# Altium project Fly_Project.PrjPcb
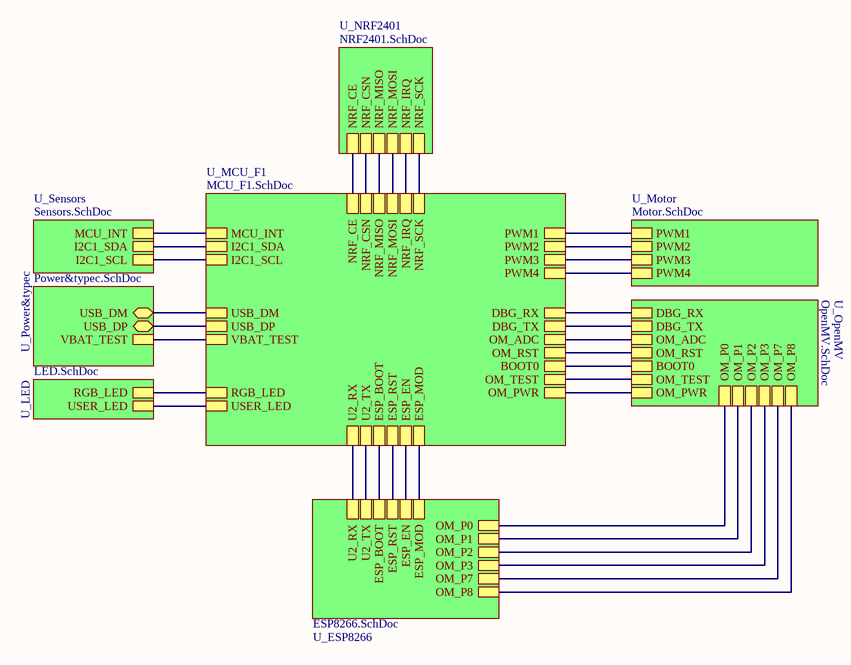
[diagram p0: Fly.SchDoc]
5 sheets, 49 parts. Net scope: hierarchical (ports join the sheet entries above them; power ports are global).
Board file: Fly.PcbDoc
Sheets:
  Fly.SchDoc
    U_LED = LED.SchDoc
    U_Sensors = Sensors.SchDoc
    U_NRF2401 = NRF2401.SchDoc
    U_OpenMV = OpenMV.SchDoc

## Sheet Fly.SchDoc
size A4

### Sub-sheets
U_ESP8266 = ESP8266.SchDoc (file not in this document): OM_P0, OM_P1, OM_P2, OM_P3, OM_P7, OM_P8, U2_RX, U2_TX, ESP_BOOT, ESP_RST, ESP_EN, ESP_MOD
U_LED = LED.SchDoc: RGB_LED, USER_LED
U_MCU_F1 = MCU_F1.SchDoc (file not in this document): OM_PWR, OM_TEST, OM_RST, VBAT_TEST, OM_ADC, U2_TX, USB_DP, USB_DM, DBG_RX, DBG_TX, NRF_CE, NRF_MOSI, NRF_MISO, NRF_SCK, NRF_CSN, U2_RX, ESP_EN, ESP_BOOT, PWM1, PWM2, PWM3, PWM4, NRF_IRQ, RGB_LED, USER_LED, BOOT0, I2C1_SDA, I2C1_SCL, ESP_RST, MCU_INT, ESP_MOD
U_Motor = Motor.SchDoc (file not in this document): PWM1, PWM2, PWM4, PWM3
U_NRF2401 = NRF2401.SchDoc: NRF_CE, NRF_CSN, NRF_MISO, NRF_MOSI, NRF_IRQ, NRF_SCK
U_OpenMV = OpenMV.SchDoc: OM_P8, OM_P7, OM_P0, OM_P1, OM_P2, OM_P3, DBG_RX, DBG_TX, OM_ADC, OM_RST, BOOT0, OM_TEST, OM_PWR
U_Power&typec = Power&typec.SchDoc (file not in this document): VBAT_TEST, USB_DM, USB_DP
U_Sensors = Sensors.SchDoc: MCU_INT, I2C1_SCL, I2C1_SDA

### Nets
BOOT0: sheet U_OpenMV/BOOT0, sheet U_MCU_F1/BOOT0
I2C1_SCL: sheet U_Sensors/I2C1_SCL, sheet U_MCU_F1/I2C1_SCL
I2C1_SDA: sheet U_Sensors/I2C1_SDA, sheet U_MCU_F1/I2C1_SDA
OM_RST: sheet U_OpenMV/OM_RST, sheet U_MCU_F1/OM_RST
OM_TEST: sheet U_OpenMV/OM_TEST, sheet U_MCU_F1/OM_TEST
NetD9_2: sheet U_LED/RGB_LED, sheet U_MCU_F1/RGB_LED
NetD11_2: sheet U_LED/USER_LED, sheet U_MCU_F1/USER_LED
NetJ1_3: sheet U_OpenMV/OM_P7, sheet U_ESP8266/OM_P7
NetJ1_4: sheet U_OpenMV/OM_P8, sheet U_ESP8266/OM_P8
NetJ2_2: sheet U_OpenMV/OM_ADC, sheet U_MCU_F1/OM_ADC
NetJ2_3: sheet U_OpenMV/DBG_TX, sheet U_MCU_F1/DBG_TX
NetJ2_4: sheet U_OpenMV/DBG_RX, sheet U_MCU_F1/DBG_RX
NetJ2_5: sheet U_OpenMV/OM_P3, sheet U_ESP8266/OM_P3
NetJ2_6: sheet U_OpenMV/OM_P2, sheet U_ESP8266/OM_P2
NetJ2_7: sheet U_OpenMV/OM_P1, sheet U_ESP8266/OM_P1
NetJ2_8: sheet U_OpenMV/OM_P0, sheet U_ESP8266/OM_P0
NetR34_1: sheet U_OpenMV/OM_PWR, sheet U_MCU_F1/OM_PWR
NetU4_1: sheet U_NRF2401/NRF_CE, sheet U_MCU_F1/NRF_CE
NetU4_2: sheet U_NRF2401/NRF_CSN, sheet U_MCU_F1/NRF_CSN
NetU4_3: sheet U_NRF2401/NRF_SCK, sheet U_MCU_F1/NRF_SCK
NetU4_4: sheet U_NRF2401/NRF_MOSI, sheet U_MCU_F1/NRF_MOSI
NetU4_5: sheet U_NRF2401/NRF_MISO, sheet U_MCU_F1/NRF_MISO
NetU4_6: sheet U_NRF2401/NRF_IRQ, sheet U_MCU_F1/NRF_IRQ
NetU6_12: sheet U_Sensors/MCU_INT, sheet U_MCU_F1/MCU_INT
(unnamed): sheet U_Power&typec/VBAT_TEST, sheet U_MCU_F1/VBAT_TEST
(unnamed): sheet U_Power&typec/USB_DM, sheet U_MCU_F1/USB_DM
(unnamed): sheet U_Power&typec/USB_DP, sheet U_MCU_F1/USB_DP
(unnamed): sheet U_Motor/PWM1, sheet U_MCU_F1/PWM1
(unnamed): sheet U_Motor/PWM2, sheet U_MCU_F1/PWM2
(unnamed): sheet U_Motor/PWM4, sheet U_MCU_F1/PWM4
(unnamed): sheet U_Motor/PWM3, sheet U_MCU_F1/PWM3
(unnamed): sheet U_ESP8266/U2_RX, sheet U_MCU_F1/U2_RX
(unnamed): sheet U_ESP8266/U2_TX, sheet U_MCU_F1/U2_TX
(unnamed): sheet U_ESP8266/ESP_BOOT, sheet U_MCU_F1/ESP_BOOT
(unnamed): sheet U_ESP8266/ESP_RST, sheet U_MCU_F1/ESP_RST
(unnamed): sheet U_ESP8266/ESP_EN, sheet U_MCU_F1/ESP_EN
(unnamed): sheet U_ESP8266/ESP_MOD, sheet U_MCU_F1/ESP_MOD

## Sheet LED.SchDoc
size A3; Organization: Altium Limited; Address1: L3, 12a Rodborough Rd; Address2: Frenchs Forest; Address3: NSW; Address4: Australia 2086
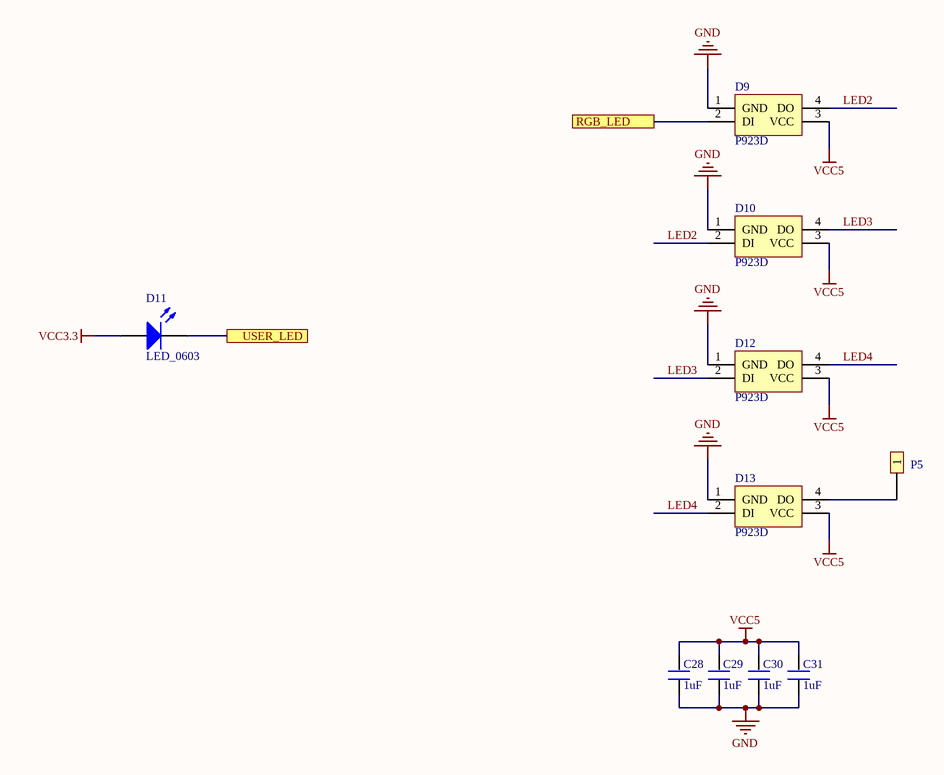
[diagram p1: LED.SchDoc]

### Parts
C28  1uF  [0603P]
C29  1uF  [0603P]
C30  1uF  [0603P]
C31  1uF  [0603P]
D9  P923D  [RGB_LED_5050]
D10  P923D  [RGB_LED_5050]
D11  LED_0603  [LED-0603]
D12  P923D  [RGB_LED_5050]
D13  P923D  [RGB_LED_5050]
P5  Header 1  [HEADER1]  (value not drawn)

### Ports
RGB_LED, USER_LED

### Nets
GND: C28.1 C29.1 C30.1 C31.1 D9.1(GND) D10.1(GND) D12.1(GND) D13.1(GND)
VCC3.3: D11.1
VCC5: C28.2 C29.2 C30.2 C31.2 D9.3(VCC) D10.3(VCC) D12.3(VCC) D13.3(VCC)
LED2: D9.4(DO) D10.2(DI)
LED3: D10.4(DO) D12.2(DI)
LED4: D12.4(DO) D13.2(DI)
NetD9_2: D9.2(DI) ; port RGB_LED
NetD11_2: D11.2 ; port USER_LED
NetD13_4: D13.4(DO) P5.1

### Notes on the sheet
- Title
- Size:
- Date:
- A3
- Number:
- Time:
- Revision:
- Sheet
- of
- File:

### Library data of the parts
C28-C31 = C
D11 = LED 0603: 发光二极管; Published: 8-Jun-2000; LatestRevisionDate: 08-Jul-2005; LatestRevisionNote: Mech Layer 1 removed.; PackageReference: LED-0; Publisher: Altium Limited; PackageDescription: LED; 2 Leads
D9 D10 D12 D13 = P923D: Publisher: mazhongwei; Published: 8-August-2017; PackageReference: RGB_LED_5050
P5 = Header 1: LatestRevisionDate: 17-Jul-2002; LatestRevisionNote: Re-released for DXP Platform.; Publisher: Altium Limited

## Sheet Sensors.SchDoc
size A3; Organization: Altium Limited; Address1: L3, 12a Rodborough Rd; Address2: Frenchs Forest; Address3: NSW; Address4: Australia 2086
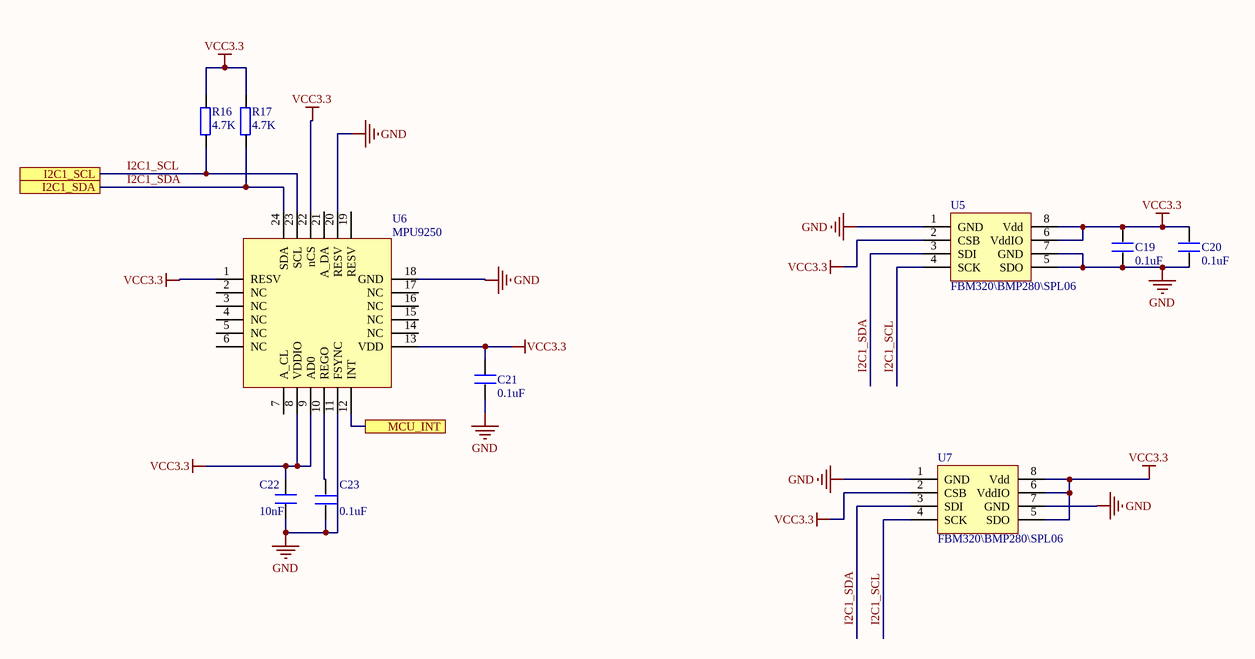
[diagram p2: Sensors.SchDoc]

### Parts
C19  0.1uF  [0603P]
C20  0.1uF  [0603P]
C21  0.1uF  [0603P]
C22  10nF  [0603P]
C23  0.1uF  [0603P]
R16  4.7K  [0603P]
R17  4.7K  [0603P]
U5  FBM320\BMP280\SPL06  [LGA-2_5X2MM]
U6  MPU9250  [QFN24-0.4]
U7  FBM320\BMP280\SPL06  [LGA-2_5X2MM]

### Ports
I2C1_SCL, I2C1_SDA, MCU_INT

### Nets
GND: C19.1 C20.1 C21.1 C22.1 C23.2 U5.1(GND) U5.5(SDO) U5.7(GND) U6.11(FSYNC) U6.18(GND) U6.20(RESV) U7.1(GND) U7.7(GND)
VCC3.3: C19.2 C20.2 C21.2 C22.2 R16.1 R17.1 U5.2(CSB) U5.6(VddIO) U5.8(Vdd) U6.1(RESV) U6.8(VDDIO) U6.9(AD0) U6.13(VDD) U6.22(nCS) U7.2(CSB) U7.5(SDO) U7.6(VddIO) U7.8(Vdd)
I2C1_SCL: R16.2 U5.4(SCK) U6.23(SCL) U7.4(SCK) ; port I2C1_SCL
I2C1_SDA: R17.2 U5.3(SDI) U6.24(SDA) U7.3(SDI) ; port I2C1_SDA
NetC23_1: C23.1 U6.10(REGO)
NetU6_12: U6.12(INT) ; port MCU_INT

Not connected (* = marked no-connect by the designer): U6 2(NC) 3(NC) 4(NC) 5(NC) 6(NC) 7(A_CL) 14(NC) 15(NC) 16(NC) 17(NC) 19(RESV) 21(A_DA)

### Notes on the sheet
- Title
- Size:
- Date:
- A3
- Number:
- Time:
- Revision:
- Sheet
- of
- File:

### Library data of the parts
C19-C23 = C
R16 R17 = R
U5 U7 = FBM320: 气压计; Published: 8-August-2017; Publisher: mazhongwei; PackageReference: LGA-2_5X2MM

## Sheet NRF2401.SchDoc
size A3; Organization: Altium Limited; Address1: L3, 12a Rodborough Rd; Address2: Frenchs Forest; Address3: NSW; Address4: Australia 2086
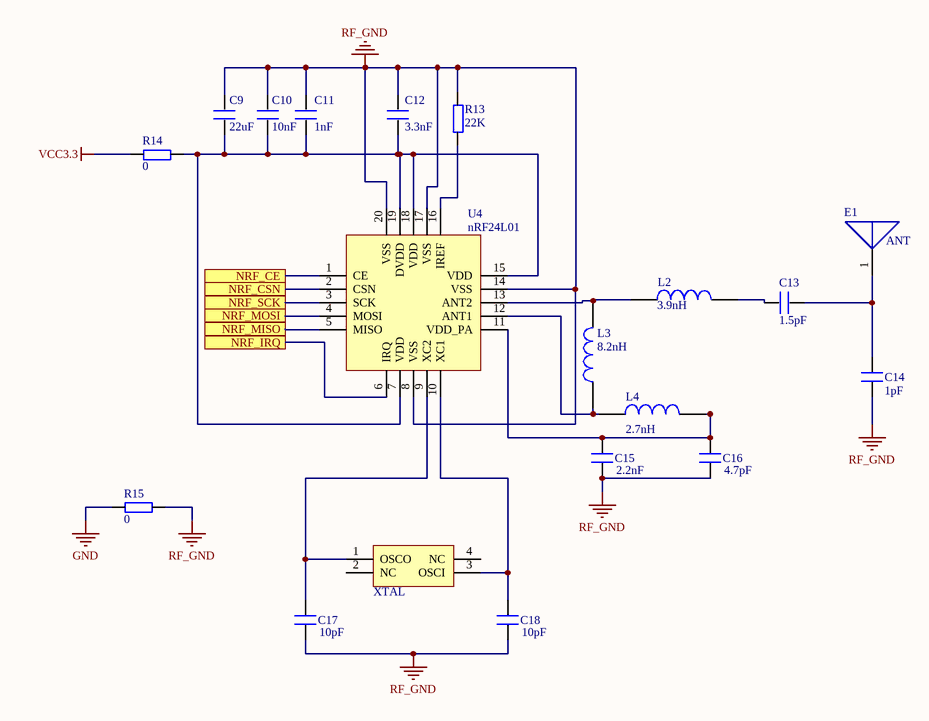
[diagram p3: NRF2401.SchDoc]

### Parts
C9  22uF  [0603P]
C10  10nF  [0603P]
C11  1nF  [0603P]
C12  3.3nF  [0603P]
C13  1.5pF  [0603P]
C14  1pF  [0603P]
C15  2.2nF  [0603P]
C16  4.7pF  [0603P]
C17  10pF  [0603P]
C18  10pF  [0603P]
E1  ANT  [ANT]
L2  INDUCTOR  [0402L]  (value not drawn)
L3  INDUCTOR  [0402L]  (value not drawn)
L4  INDUCTOR  [0402L]  (value not drawn)
R13  22K  [0603P]
R14  0  [0603P]
R15  0  [0603P]
U4  nRF24L01  [QFN20]
XTAL1  XTAL  [SMD-3225_4P]

### Ports
NRF_CE, NRF_CSN, NRF_IRQ, NRF_MISO, NRF_MOSI, NRF_SCK

### Nets
GND: R15.1
RF_GND: C9.1 C10.1 C11.1 C12.1 C14.1 C15.2 C16.2 C17.2 C18.2 R13.2 R15.2 U4.8(VSS) U4.14(VSS) U4.17(VSS) U4.20(VSS)
VCC3.3: R14.1
NetC9_2: C9.2 C10.2 C11.2 C12.2 R14.2 U4.7(VDD) U4.15(VDD) U4.18(VDD) U4.19(DVDD)
NetC13_1: C13.1 L2.2
NetC13_2: C13.2 C14.2 E1.1
NetC15_1: C15.1 C16.1 L4.2 U4.11(VDD_PA)
NetC17_1: C17.1 U4.9(XC2) XTAL1.1(OSCO)
NetC18_1: C18.1 U4.10(XC1) XTAL1.3(OSCI)
NetL2_1: L2.1 L3.2 U4.13(ANT2)
NetL3_1: L3.1 L4.1 U4.12(ANT1)
NetR13_1: R13.1 U4.16(IREF)
NetU4_1: U4.1(CE) ; port NRF_CE
NetU4_2: U4.2(CSN) ; port NRF_CSN
NetU4_3: U4.3(SCK) ; port NRF_SCK
NetU4_4: U4.4(MOSI) ; port NRF_MOSI
NetU4_5: U4.5(MISO) ; port NRF_MISO
NetU4_6: U4.6(IRQ) ; port NRF_IRQ

Not connected (* = marked no-connect by the designer): XTAL1 2(NC) 4(NC)

### Notes on the sheet
- Title
- Size:
- Date:
- A3
- Number:
- Time:
- Revision:
- Sheet
- of
- File:
- (in symbol INDUCTOR) 3.9nH; 8.2nH; 2.7nH

### Library data of the parts
C9-C18 = C
R13-R15 = R
XTAL1 = XTAL16M: Value: 16MHz
E1 = ANT: Published: 12-August-2017; Publisher: mazhongwei; PackageReference: R_1206

## Sheet OpenMV.SchDoc
size A3; Organization: Altium Limited; Address1: L3, 12a Rodborough Rd; Address2: Frenchs Forest; Address3: NSW; Address4: Australia 2086
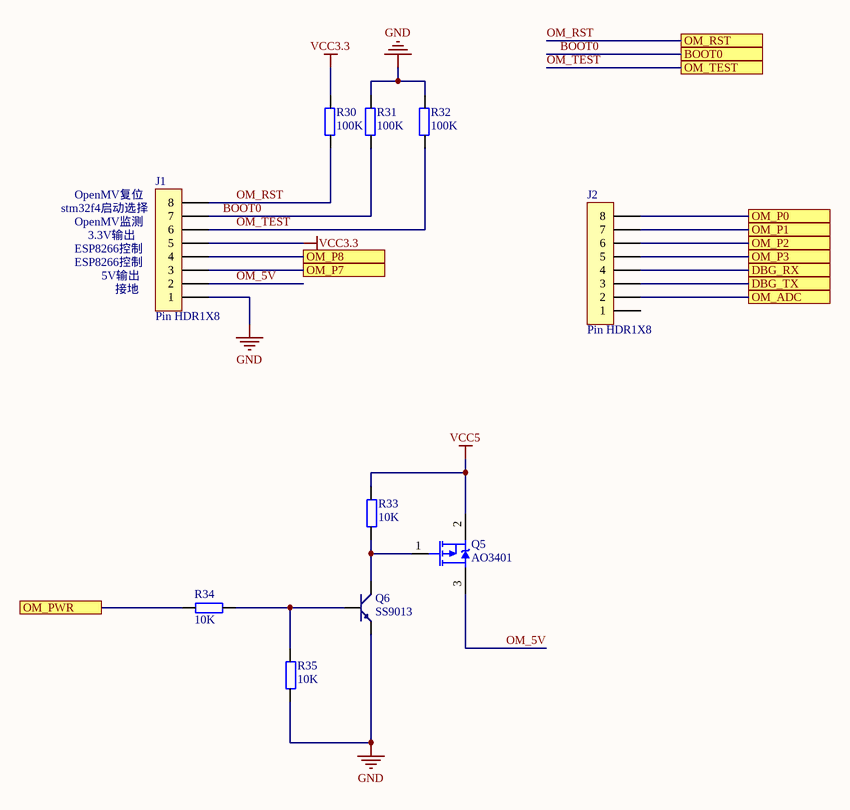
[diagram p4: OpenMV.SchDoc]

### Parts
J1  Pin HDR1X8  [Pin HDR1X8/2.54mm-S]
J2  Pin HDR1X8  [Pin HDR1X8/2.54mm-S]
Q5  AO3401  [SOT23-3M]
Q6  SS9013  [SOT-23R]
R30  100K  [0603P]
R31  100K  [0603P]
R32  100K  [0603P]
R33  10K  [0603P]
R34  10K  [0603P]
R35  10K  [0603P]

### Ports
BOOT0, DBG_RX, DBG_TX, OM_ADC, OM_P0, OM_P1, OM_P2, OM_P3, OM_P7, OM_P8, OM_PWR, OM_RST, OM_TEST

### Nets
GND: J1.1 Q6.1(E) R31.1 R32.1 R35.1
VCC3.3: J1.5 R30.1
VCC5: Q5.2(S) R33.2
BOOT0: J1.7 R31.2 ; port BOOT0
OM_5V: J1.2 Q5.3(D)
OM_RST: J1.8 R30.2 ; port OM_RST
OM_TEST: J1.6 R32.2 ; port OM_TEST
NetJ1_3: J1.3 ; port OM_P7
NetJ1_4: J1.4 ; port OM_P8
NetJ2_2: J2.2 ; port OM_ADC
NetJ2_3: J2.3 ; port DBG_TX
NetJ2_4: J2.4 ; port DBG_RX
NetJ2_5: J2.5 ; port OM_P3
NetJ2_6: J2.6 ; port OM_P2
NetJ2_7: J2.7 ; port OM_P1
NetJ2_8: J2.8 ; port OM_P0
NetQ5_1: Q5.1(G) Q6.3(C) R33.1
NetQ6_2: Q6.2(B) R34.2 R35.2
NetR34_1: R34.1 ; port OM_PWR

Not connected (* = marked no-connect by the designer): J2 1

### Notes on the sheet
- OpenMV复位
- stm32f4启动选择
- OpenMV监测
- (near J1) ESP8266控制
- 3.3V输出
- 5V输出
- 接地
- Title
- Size:
- Date:
- A3
- Number:
- Time:
- Revision:
- Sheet
- of
- File:

### Library data of the parts
Q5 = MOSFET-P: MOS管_P沟道; PackageDocument: 1995/1996; Published: 8-Jun-2000; LatestRevisionDate: 17-Jul-2002; LatestRevisionNote: Re-released for DXP Platform.; PackageReference: E3; Publisher: Altium Limited
Q6 = NPN: 8050/BCW846/BCW847
R30-R35 = R

## Nets that join several sheets
GND: LED (8 pins), Sensors (13 pins), NRF2401 (R15.1), OpenMV (5 pins)
VCC3.3: LED (D11.1), Sensors (18 pins), NRF2401 (R14.1), OpenMV (J1.5 R30.1)
VCC5: LED (8 pins), OpenMV (Q5.2 R33.2)